# EAGLE design kritzler_shield (EAGLE 6.1)
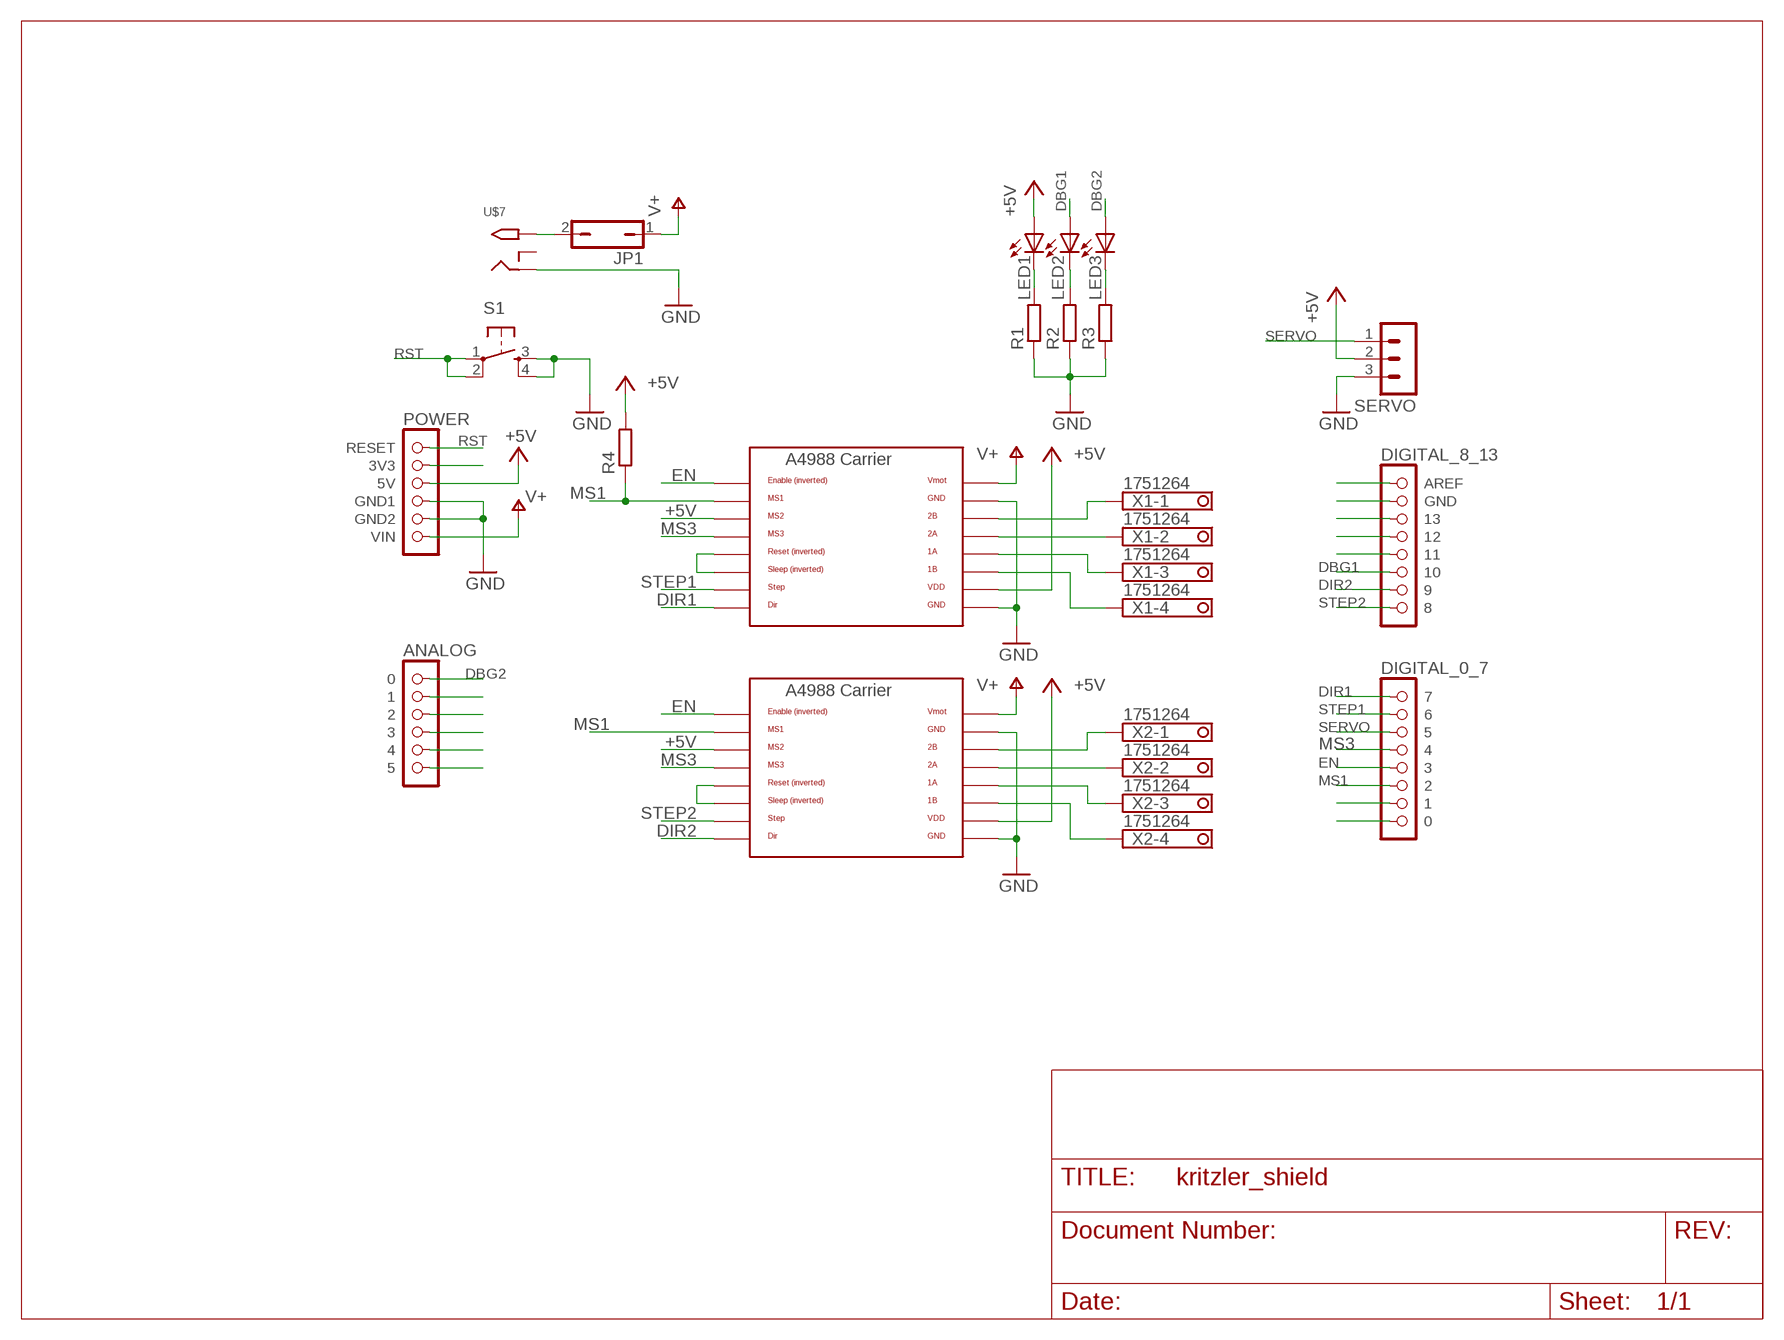
[diagram p0: schematic, sheet 1]

## Parts
JP1  JP1Q  [JP1]
LED1  LED5MM  [LED5MM]
LED2  LED5MM  [LED5MM]
LED3  LED5MM  [LED5MM]
R1  R-EU_0207/10  [0207/10]
R2  R-EU_0207/10  [0207/10]
R3  R-EU_0207/10  [0207/10]
R4  R-EU_0207/10  [0207/10]
S1  TAC_SWITCHPTH  [TACTILE-PTH]
SERVO  MA03-1  [MA03-1]
U$1  POWER  [1X06]
U$2  ANALOG  [1X06]
U$3  DIGITAL_0_7  [1X08]
U$4  DIGITAL_8_13  [1X08]
U$5  A4988BREAKOUT  [A4988BREAKOUT]
U$6  A4988BREAKOUT  [A4988BREAKOUT]
U$7  2.1MMJACKTHM  [PJ-102A]
X1  1751264  [1751264]
X2  1751264  [1751264]

## Nets
+5V: LED1.A R4.2 SERVO.2 U$1.3(5V) U$5.MS2 U$5.VDD U$6.MS2 U$6.VDD
DBG1: LED2.A U$4.6
DBG2: LED3.A U$2.1
DIR1: U$3.1 U$5.DIR
DIR2: U$4.7 U$6.DIR
EN: U$3.5 U$5.EN U$6.EN
GND: R1.1 R2.1 R3.1 S1.3 S1.4 SERVO.3 U$1.4(GND1) U$1.5(GND2) U$5.GND U$5.GND@0(GND) U$6.GND U$6.GND@0(GND) U$7.RING
MS1: R4.1 U$3.6 U$5.MS1 U$6.MS1
MS3: U$3.4 U$5.MS3 U$6.MS3
N$1: JP1.2 U$7.TIP
N$2: U$4.1(AREF)
N$3: U$4.2(GND)
N$4: LED1.K(C) R1.2
N$5: LED2.K(C) R2.2
N$6: LED3.K(C) R3.2
N$7: U$4.3
N$10: U$5.2A X1.2
N$11: U$5.1A X1.3
N$12: U$5.1B X1.4
N$13: U$5.2B X1.1
N$14: U$6.2A X2.2
N$15: U$6.2B X2.1
N$16: U$6.1A X2.3
N$17: U$6.1B X2.4
N$18: U$1.2(3V3)
N$19: U$2.2
N$20: U$2.3
N$21: U$2.4
N$22: U$2.5
N$23: U$2.6
N$24: U$6.RST U$6.SLP(SLEEP)
N$25: U$5.RST U$5.SLP(SLEEP)
RST: S1.1 S1.2 U$1.1(RESET)
SERVO: SERVO.1 U$3.3
STEP1: U$3.2 U$5.STEP
STEP2: U$4.8 U$6.STEP
T1: U$3.8
T2: U$3.7
V+: JP1.1 U$1.6(VIN) U$5.VMOT U$6.VMOT
X2: U$4.5
X3: U$4.4
Unconnected: U$7.RING_SW

## Library data of the parts
JP1 = jumper:JP1Q: JUMPER
LED1-LED3 = led:LED: LED OSRAM: - CHIPLED LG R971, LG N971, LY N971, LG Q971, LY Q971, LO R971, LY R971 LH N974, LH R974 LS Q976, LO Q976, LY Q976 LO Q996 - Hyper CHIPLED LW Q18S LB Q993, LB Q99A, LB R99A - SideLED LS A670, LO A670, LY A670, LG A670, LP A670 LB A673, LV A673, LT A673, LW A673 LH A674 LY A675 LS A676, LA A676, LO A676, LY A676, LW A676 LS A679, LY A679, LG A679 - Hyper Micro SIDELED® LS Y876, LA Y876, LO Y876, LY Y876 LT Y87S - SmartLED LW L88C, LW L88S LB L89C, LB L89S, LG L890 LS L89K, LO L89K, LY L89K LS L896, LA L896, LO L896, LY L896 - TOPLED LS T670, LO T670, LY T670, LG T670, LP T670 LSG T670, LSP T670, LSY T670, LOP T670, LYG T670 LG T671, LOG T671, LSG T671 LB T673, LV T673, LT T673, LW T673 LH T674 LS T676, LA T676, LO T676, LY T676, LB T676, LH T676, LSB T676, LW T676 LB T67C, LV T67C, LT T67C, LS T67K, LO T67K, LY T67K, LW E67C LS E67B, LA E67B, LO E67B, LY E67B, LB E67C, LV E67C, LT E67C LW T67C LS T679, LY T679, LG T679 LS T770, LO T770, LY T770, LG T770, LP T770 LB T773, LV T773, LT T773, LW T773 LH T774 LS E675, LA E675, LY E675, LS T675 LS T776, LA T776, LO T776, LY T776, LB T776 LHGB T686 LT T68C, LB T68C - Hyper Mini TOPLED® LB M676 - Mini TOPLED Santana® LG M470 LS M47K, LO M47K, LY M47K Source: http://www.osram.convergy.de LUXEON: - LUMILED® LXK2-PW12-R00, LXK2-PW12-S00, LXK2-PW14-U00, LXK2-PW14-V00 LXK2-PM12-R00, LXK2-PM12-S00, LXK2-PM14-U00 LXK2-PE12-Q00, LXK2-PE12-R00, LXK2-PE12-S00, LXK2-PE14-T00, LXK2-PE14-U00 LXK2-PB12-K00, LXK2-PB12-L00, LXK2-PB12-M00, LXK2-PB14-N00, LXK2-PB14-P00, LXK2-PB14-Q00 LXK2-PR12-L00, LXK2-PR12-M00, LXK2-PR14-Q00, LXK2-PR14-R00 LXK2-PD12-Q00, LXK2-PD12-R00, LXK2-PD12-S00 LXK2-PH12-R00, LXK2-PH12-S00 LXK2-PL12-P00, LXK2-PL12-Q00, LXK2-PL12-R00 Source: www.luxeon.com KINGBRIGHT: KA-3528ASYC Source: www.kingbright.com
R1-R4 = rcl:R-EU_: RESISTOR, European symbol
S1 = SparkFun:TAC_SWITCH: Momentary Switch Button commonly used for reset or general input. Spark Fun Electronics SKU : COM-00097
SERVO = con-lstb:MA03-1: PIN HEADER
U$1 = arduino:POWER
U$2 = arduino:ANALOG
U$3 = arduino:DIGITAL_0_7
U$4 = arduino:DIGITAL_8_13
U$5 U$6 = RepRapjr:A4988BREAKOUT
U$7 = adafruit:2.1MMJACK: 2.1mm x 5.5mm THM DC jack with internal switch. Digikey part #PJ-102A, 4UCON part #05537 2.1mm x 5.5mm SMT DC jack with internal switch. Digikey part #PJ-002A-SMT, 4UCON part #03267 By microbuilder.eu & adafruit.com
X1 X2 = con-phoenix-350:1751264: MKDS 1/ 4-3,5 Printklemme Nennstrom: 10 A Bemessungsspannung: 160 V Raster: 3,5 mm Polzahl: 4 Montageart: Löten Anschlussart: Schraubanschluss Anschlussrichtung vom Leiter zur Platine: 0° Source: http://eshop.phoenixcontact.com .. 1751264.pdf

## Board
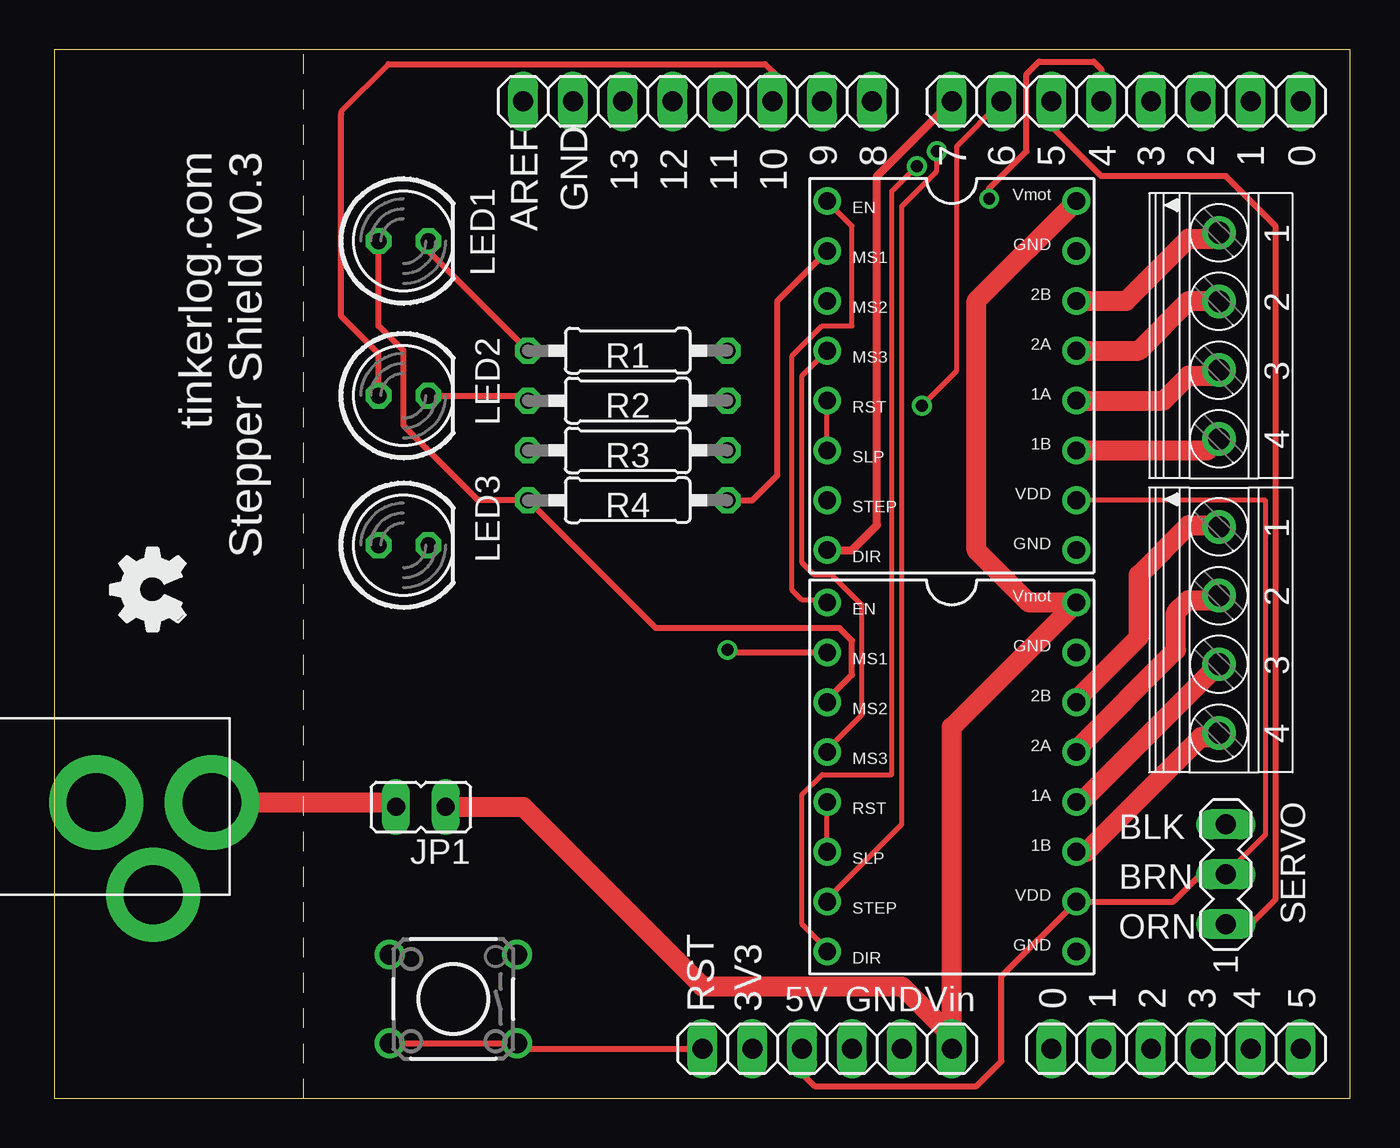
[diagram p1: board, top side]
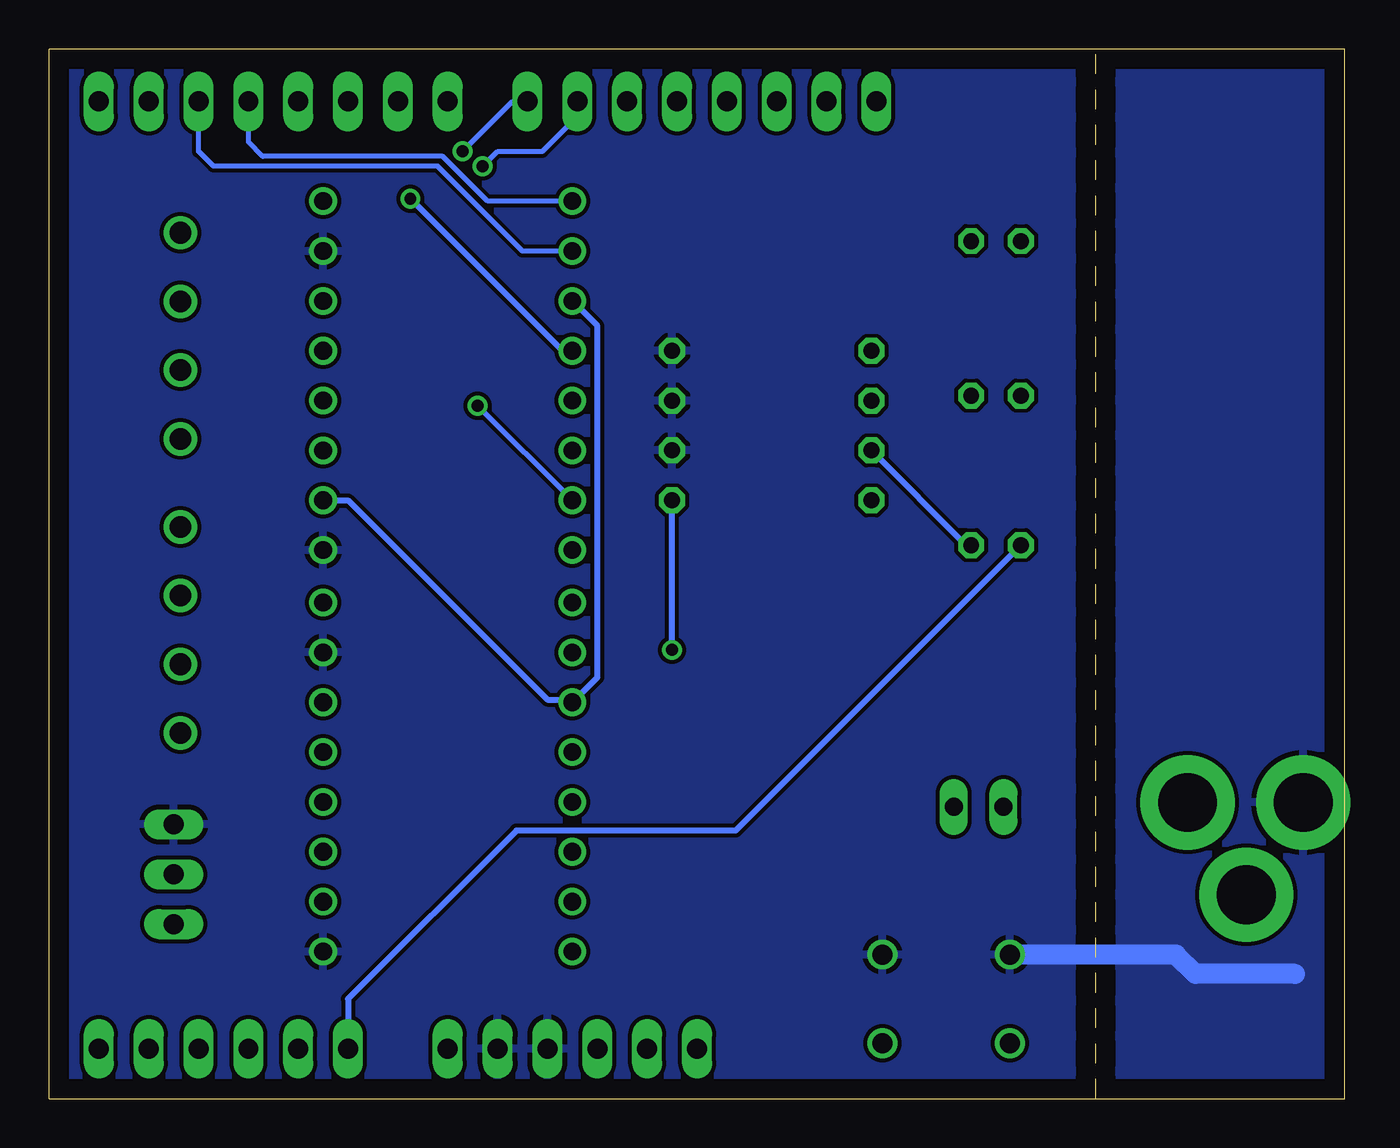
[diagram p2: board, bottom side, seen from below]

Size 66.04 x 53.47 mm. Coordinates in mm from the lower left corner, seen from the top.
Outline: 12.7,53.47 0,53.47 0,0 12.7,0
Outline: 12.7,53.47 66.04,53.47 66.04,0 12.7,0
Outline: 12.7,0 12.7,53.47
Copper layers (1*16): Top 0.035mm / dielectric 1.5mm / Bottom 0.035mm
Design rules: minimum track width 10mil, minimum drill 24mil, track to track 8mil, track to pad 8mil, pad to pad 8mil, via to via 8mil, smd to smd 8mil, copper to edge 40mil, drill to drill 8mil, minimum pad ring 10mil, minimum via ring 8mil, stop-mask expansion 4mil, vias tented up to drill 0mil, thermal gap 10mil

### Footprints (pad centres in the part's own frame; a part is rotated, then mirrored left to right if it is on the bottom)
JP1 = drill 0.914 long: 1 0,-1.27; 2 0,1.27
LED5MM = drill 0.813 octagon: A -1.27,0; K 1.27,0
0207/10 = drill 0.813 octagon: 1 -5.08,0; 2 5.08,0
TACTILE-PTH = drill 1.016: 1 -3.251,2.261; 2 3.251,2.261; 3 -3.251,-2.261; 4 3.251,-2.261
MA03-1 = drill 1.016 long: 1 -2.54,0; 2 0,0; 3 2.54,0
1X06 = drill 1.016 long: 1 -6.35,0; 2 -3.81,0; 3 -1.27,0; 4 1.27,0; 5 3.81,0; 6 6.35,0
1X08 = drill 1.016 long: 1 -8.89,0; 2 -6.35,0; 3 -3.81,0; 4 -1.27,0; 5 1.27,0; 6 3.81,0; 7 6.35,0; 8 8.89,0
A4988BREAKOUT = drill 0.9: 1A 8.89,1.27; 1B 11.43,1.27; 2A 6.35,1.27; 2B 3.81,1.27; DIR 16.51,-11.43; EN -1.27,-11.43; GND 16.51,1.27; GND@0 1.27,1.27; MS1 1.27,-11.43; MS2 3.81,-11.43; MS3 6.35,-11.43; RST 8.89,-11.43; SLP 11.43,-11.43; STEP 13.97,-11.43; VDD 13.97,1.27; VMOT -1.27,1.27
PJ-102A = drill 3 pad 4.8: RING 0.1,-3.39; RING_SW -4.6,-6.29; TIP 0.1,-9.29
1751264 = drill 1.1 pad 1.7: 1 -5.25,-0.1; 2 -1.75,-0.1; 3 1.75,-0.1; 4 5.25,-0.1
FPS009-3000 = smd 2.65 x 1.1: 1 -0.915,-5.3; 2 -0.415,-7.8; 3 0.385,-10.3; 4 0.385,-12.8; 5 -0.415,-15.3; 6 -0.415,-17.8; 7 -0.415,-20.3; 8 -0.415,-21.925; 9 1.885,-2.8 | smd 3.5 x 1: COM_TERM -16.75,-24.55 | smd 2.5 x 1.4: DETECT -17.25,-22.85 | smd 3 x 2.7: M1 2.85,1.55; M2 2.85,-26.55 | smd 3.5 x 1.4: WRITE_PROT -16.75,-25.95 | hole 1.6: 0,0 | hole 1.1: 0,-24.8

### Placement (x,y rotation side)
JP1  18.67,14.86 90 top
LED1  17.78,43.69 0 top
LED2  17.78,35.81 0 top
LED3  17.78,28.19 0 top
R1  29.21,38.1 180 top
R2  29.21,35.56 180 top
R3  29.21,33.02 180 top
R4  29.21,30.48 180 top
S1  20.32,5.08 180 top
SERVO  59.69,11.43 90 top
U$1  39.37,2.54 0 top
U$2  57.15,2.54 0 top
U$3  54.61,50.8 0 top
U$4  32.77,50.8 0 top
U$5  50.8,44.45 270 top
U$6  50.8,24 270 top
U$7  -1.27,14.99 90 top
U$8  [OSHW_FILLX150_NOTEXT]  6.67,23.81 90 top
X1  59.44,38.86 270 top
X2  59.44,23.88 270 top
X3  FPS009-3002  [FPS009-3000]  -26.67,29.21 0 top  (outside the outline)

### Tracks (layer width: path | path; a pad name or v marks a point on that pad's centre or on a via)
+5V
  Top 0.254: U$5.VDD 61.72,30.48 61.72,13.46 SERVO.2
  Top 0.305: U$1.3 38.1,1.27 38.73,0.64 46.99,0.64 48.26,1.91 48.26,6.22 U$6.VDD 57.02,10.03 58.42,11.43 SERVO.2 | U$6.MS2 39.37,20.32 40.64,21.59 40.64,23.34 40.01,23.97 30.64,23.97 R4.2 21.59,30.48 17.78,34.29 17.78,38.1 16.51,39.37 LED1.A
  Bottom 0.305: U$5.MS2 38.1,39.37 38.1,21.46 U$6.MS2 39.5,20.32 40.64,20.32 50.8,30.48 U$5.VDD
DBG1
  Top 0.254: 14.61,50.16 14.61,50.29 17.02,52.7
  Top 0.305: LED2.A 16.51,37.94 14.61,39.85 14.61,50.16 | 17.02,52.7 36.2,52.7 36.83,52.07 36.83,51.05 U$4.6
DBG2
  Bottom 0.305: U$2.1 50.8,5.08 42.23,13.65 31.05,13.65 LED3.A
DIR1
  Top 0.406: U$5.DIR 40.64,27.94 41.91,29.21 41.91,46.99 U$3.1
DIR2  (via drill 0.61)
  Top 0.254: v43.94,47.5 42.67,46.23 42.67,16.51 39.12,16.51 38.1,15.49 38.1,8.89 39.37,7.62 U$6.DIR
  Bottom 0.254: v43.94,47.5 43.18,48.26 40.89,48.26 39.12,50.04 U$4.7
EN
  Top 0.254: U$5.EN 40.64,44.45 40.64,39.37 39.12,39.37 37.59,37.85 37.59,25.91 38.1,25.4 39.24,25.4 U$6.EN 39.37,25.4
  Bottom 0.254: U$5.EN 43.69,45.72 45.97,48.01 55.15,48.01 55.88,48.74 U$3.5
GND
  Bottom 1.016: S1.4 8.61,7.34 7.62,6.35 2.54,6.35
  pour Bottom: 0,53.34 0,0 68.58,0 68.58,53.34
MS1  (via drill 0.6)
  Top 0.305: R4.1 35.56,30.48 36.83,31.75 36.83,40.64 U$5.MS1 | U$6.MS1 34.42,22.73 v34.29,22.86
  Bottom 0.254: U$5.MS1 41.91,43.18 46.23,47.5 57.66,47.5 58.42,48.26 U$3.6
  Bottom 0.305: v34.29,22.86 R4.1
MS3  (via drill 0.6)
  Top 0.254: U$5.MS3 38.1,36.83 38.1,27.3 38.73,26.67 39.62,26.67 41.15,25.15 41.15,19.56 39.37,17.78 U$6.MS3
  Top 0.305: v47.62,45.85 47.62,46.35 49.53,48.26 49.53,52.2 50.16,52.83 52.96,52.83 53.34,52.45 U$3.4
  Bottom 0.305: U$5.MS3 39.88,38.1 v47.62,45.85
N$1
  Top 1.016: U$7.TIP 17.17,15.09 JP1.2
N$4
  Top 0.305: LED1.K 19.05,43.18 R1.2
N$5
  Top 0.305: LED2.K 23.88,35.81 R2.2
N$6
  Bottom 0.305: LED3.K 19.3,28.19 R3.2
N$10
  Top 1.016: U$5.2A 55.24,38.1 57.78,40.64 59.31,40.64 X1.2
N$11
  Top 1.016: U$5.1A 56.52,35.56 57.78,36.83 59.05,36.83 X1.3
N$12
  Top 1.016: U$5.1B 58.74,33.02 X1.4
N$13
  Top 1.016: U$5.2B 54.61,40.64 57.78,43.81 59.04,43.81 X1.1
N$14
  Top 1.016: U$6.2A 52.07,17.78 57.15,22.86 57.15,24.77 57.78,25.4 59.11,25.4 X2.2
N$15
  Top 1.016: U$6.2B 52.07,20.32 55.24,23.5 55.24,26.67 57.78,29.21 59.25,29.21 X2.1
N$16
  Top 1.016: U$6.1A 52.32,15.11 X2.3
N$17
  Top 1.016: U$6.1B 52.58,12.57 58.42,18.41 59.12,18.41 X2.4
N$24
  Top 0.254: U$6.SLP U$6.RST
N$25
  Top 0.254: U$5.SLP U$5.RST
RST
  Top 0.305: U$1.1 23.85,2.54 S1.1 S1.2
SERVO
  Top 0.305: SERVO.1 60.96,8.89 62.23,10.16 62.23,44.45 59.69,46.99 53.34,46.99 50.8,49.53 U$3.3
STEP1  (via drill 0.61)
  Top 0.254: v44.2,35.31 45.97,37.08 45.97,48.51 U$3.2
  Bottom 0.254: U$5.STEP v44.2,35.31
STEP2  (via drill 0.61)
  Top 0.254: v44.96,48.26 44.96,47.24 43.18,45.47 43.18,13.97 39.37,10.16 U$6.STEP
  Bottom 0.254: v44.96,48.26 42.42,50.8 U$4.8
V+
  Top 1.016: JP1.1 23.88,14.86 33.02,5.71 43.18,5.71 45.72,3.17 U$1.6 45.72,18.92 U$6.VMOT 49.66,25.27 46.99,27.94 46.99,40.64 U$5.VMOT

### Text on the board
tPlace: tinkerlog.com | Stepper Shield v0.3 | BLK | BRN | ORN
tNames: 9 | 8 | 7 | 6 | 5 | 4 | 3 | 2 | 1 | 0 | 13 | 12 | 11 | 10 | GND | AREF | 0 | 1 | 2 | 3 | 4 | 5 | RST | 3V3 | 5V | GND | Vin
TallParts: USB | PWR